# Altium schematic sheet Lab5_prelab1.SchDoc
size A4; SheetNumber: 1; SheetTotal: 1; SPICEModelCacheFLLGQUAP: <root> / <DocumentId>FLLGQUAP</DocumentId> / <CacheFrame Number="0"> / <Model Name="lf353" Kind="CKT"> / <Text>*////////////////////////////////////////////////////////// / *LF353 Wide Bandwidth Dual JFET-Input OP-AMP MACRO-MODEL / *////////////////////////////////////////////////////////// / * / * connections:    non-inverting input / *                 |   inverting input / *                 |   |   positive power supply / *                 |   |   |   negative power supply / *                 |   |   |   |   output / *                 |   |   |   |   | / *                 |   |   |   |   | / .SUBCKT LF353     1   2  99  50  28 / * / * PINOUT ORDER +IN -IN V+ V- OUT / * / * / *Features: / *Low supply current =                1.8mA / *Wide bandwidth =                     4MHz / *High slew rate =                   13V/uS / *Low offset voltage =                 10mV / * / *NOTE: Model is for single device only and simulated / *      supply current is 1/2 of total device current. / * / ****************INPUT STAGE************** / * / IOS 2 1 25P / *^Input offset current / R1 1 3 1E12 / R2 3 2 1E12 / I1 99 4 100U / J1 5 2 4 JX / J2 6 7 4 JX / R3 5 50 20K / R4 6 50 20K / *Fp2=12 MHz / C4 5 6 3.31573E-13 / * / ***********COMMON MODE EFFECT*********** / * / I2 99 50 1.7MA / *^Quiescent supply current / EOS 7 1 POLY(1) 16 49 5E-3 1 / *Input offset voltage.^ / R8 99 49 50K / R9 49 50 50K / * / *********OUTPUT VOLTAGE LIMITING******** / V2 99 8 2.13 / D1 9 8 DX / D2 10 9 DX / V3 10 50 2.13 / * / **************SECOND STAGE************** / * / EH 99 98 99 49 1 / F1 9 98 POLY(1) VA3 0 0 0 1.0985E7 / G1 98 9 5 6 1E-3 / R5 98 9 100MEG / VA3 9 11 0 / *Fp1=40.3 HZ / C3 98 11 39.493P / * / ***************POLE STAGE*************** / * / *Fp3=42 MHz / G3 98 15 9 49 1E-6 / R12 98 15 1MEG / C5 98 15 3.7894E-15 / * / *********COMMON-MODE ZERO STAGE********* / * / G4 98 16 3 49 1E-8 / L2 98 17 31.831M / R13 17 16 1K / * / **************OUTPUT STAGE************** / * / F6  99 50 VA7 1 / F5  99 23 VA8 1 / D5  21 23 DX / VA7 99 21 0 / D6  23 99 DX / E1  99 26 99 15 1 / VA8 26 27 0 / R16 27 28 35 / V5  28 25 0.1V / D4  25 15 DX / V4  24 28 0.1V / D3  15 24 DX / * / ***************MODELS USED************** / * / .MODEL DX D(IS=1E-15) / .MODEL JX PJF(BETA=1.25E-5 VTO=-2.00 IS=50E-12) / * / .ENDS</Text> / </Model> / <Model Name="1n4148" Kind="MDL"> / <Text>.model 1N4148  D(Is=0.1p Rs=16 CJO=2p Tt=12n Bv=100 Ibv=0.1p)</Text> / </Model> / <Model Name="cap" Kind="MDL"> / <Text>*Default semiconductor capacitor / .MODEL CAP C()</Text> / </Model> / </CacheFrame> / </root>
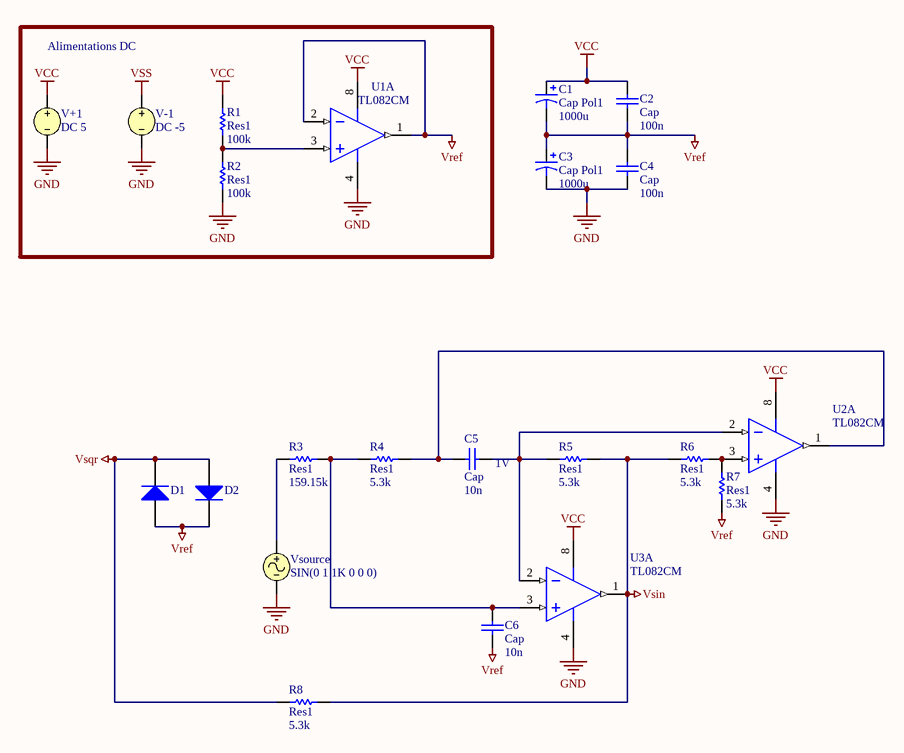
[diagram p0: Lab5_prelab1.SchDoc]

## Parts
C1  Cap Pol1  value 1000u  [RB7.6-15]
C2  Cap  value 100n  [RAD-0.3]
C3  Cap Pol1  value 1000u  [RB7.6-15]
C4  Cap  value 100n  [RAD-0.3]
C5  Cap  value 10n  Initial Voltage: 1V  [RAD-0.3]
C6  Cap  value 10n  [RAD-0.3]
D1  Diode 1N4148  [DO-35]  (value not drawn)
D2  Diode 1N4148  [DO-35]  (value not drawn)
R1  Res1  value 100k  [AXIAL-0.3]
R2  Res1  value 100k  [AXIAL-0.3]
R3  Res1  value 159.15k  [AXIAL-0.3]
R4  Res1  value 5.3k  [AXIAL-0.3]
R5  Res1  value 5.3k  [AXIAL-0.3]
R6  Res1  value 5.3k  [AXIAL-0.3]
R7  Res1  value 5.3k  [AXIAL-0.3]
R8  Res1  value 5.3k  [AXIAL-0.3]
U1  TL082CM  [M08A_N]  (part A of 2)
U2  TL082CM  [M08A_N]  (part A of 2)
U3  TL082CM  [M08A_N]  (part A of 2)
V+1  DC 5
V-1  DC -5
Vsource  SIN(0 1 1K 0 0 0)

## Blocks framed on the sheet
Alimentations DC: R1 R2 U1 V+1 V-1

## Nets
GND: C3.2 C4.1 R2.1 U1.4(V-) U2.4(V-) U3.4(V-) V+1.2 V-1.2 Vsource.2
VCC: C1.1 C2.2 R1.2 U1.8(V+) U2.8(V+) U3.8(V+) V+1.1
Vref: C1.2 C2.1 C3.1 C4.2 C6.1 D1.1(A) D2.2(K) R7.1 U1.1(OUTA) U1.2(INA-)
Vsin: R5.1 R6.2 R8.2 U3.1(OUTA)
Vsqr: D1.2(K) D2.1(A) R8.1
VSS: V-1.1
NetC5_1: C5.1 R4.2 U2.1(OUTA)
NetC5_2: C5.2 R5.2 U2.2(INA-) U3.2(INA-)
NetC6_2: C6.2 R3.2 R4.1 U3.3(INA+)
NetR1_1: R1.1 R2.2 U1.3(INA+)
NetR3_1: R3.1 Vsource.1
NetR6_1: R6.1 R7.2 U2.3(INA+)

## Library data of the parts
C1 C3 = Cap Pol1: Polarized Capacitor (Radial); Published: 8-Jun-2000; LatestRevisionDate: 17-Jul-2002; LatestRevisionNote: Re-released for DXP Platform.; PackageReference: RB7.6-15; Publisher: Altium Limited; PackageDescription: Polarized Capacitor (Radial); 2 Leads
C2 C4-C6 = Cap: Capacitor; Published: 8-Jun-2000; LatestRevisionDate: 17-Jul-2002; LatestRevisionNote: Re-released for DXP Platform.; PackageReference: RAD-0.3; Publisher: Altium Limited; PackageDescription: Radial Cap, Thru-Hole; 2 Leads; 0.3 in Pin Spacing
D1 D2 = Diode 1N4148: High Conductance Fast Diode; Published: 8-Jun-2000; LatestRevisionDate: 17-Jul-2002; LatestRevisionNote: Re-released for DXP Platform.; DatasheetVersion: 1997; PackageReference: DO-35; Publisher: Altium Limited; PackageDescription: Diode, Axial; Body 3.8 x 1.9 mm (LxDia. max), Lead Dia. 0.53 mm (max); Code_JEDEC: DO-204-AH; ComponentLink1Description: Manufacturer Link; ComponentLink1URL: http://www.fairchildsemi.com/; ComponentLink2Description: Datasheet; ComponentLink2URL: http://www.fairchildsemi.com/ds/1N%2F1N4148.pdf
R1-R8 = Res1: Resistor; Published: 8-Jun-2000; LatestRevisionDate: 17-Jul-2002; LatestRevisionNote: Re-released for DXP Platform.; PackageReference: AXIAL-0.3; Publisher: Altium Limited; PackageDescription: Axial Device, Thru-Hole; 2 Leads; 0.3 in Pin Spacing
U1-U3 = TL082CM: Wide Bandwidth Dual JFET Input Operational Amplifier; Manufacturer: National Semiconductor; CompType: Amplifiers; PackageTopMarking: NSZXTT*TL*082CM; PowerWise: N; Published: 4-Dec-2008; LatestRevisionDate: 13-Jan-2009; LatestRevisionNote: Sim Model Added.; DatasheetVersion: Aug-2000; PackageVersion: revL, Sep-2006; PackageReference: M08A; Publisher: Altium Limited; PackageDescription: SOIC Narrow, 4.9 x 3.9 x 1.45mm, 8 Lead, 1.27mm Pitch; PartNumber: TL082CM; RoHS: Y; PinCount: 8; DigiKeyPartNumber: TL082CM-ND; Code_JEDEC: MS-012-AA; Code_IPC: SOIC127P600-8; ComponentLink1Description: TL082 Datasheet; ComponentLink1URL: http://www.national.com/ds/TL/TL082.pdf; ComponentLink2Description: TL082 Web Page; ComponentLink2URL: http://www.national.com/pf/TL/TL082.html; ComponentLink3Description: M08A Package Page; ComponentLink3URL: http://www.national.com/packaging/folders/m08a.html
V+1 = VSRC: Voltage Source; Note: PCB Footprint - Not required; Value: 5; Published: 8-Jun-2000; LatestRevisionDate: 17-Jul-2002; LatestRevisionNote: Re-released for DXP Platform.; PackageReference: Not Applicable; Publisher: Altium Limited
V-1 = VSRC: Voltage Source; Note: PCB Footprint - Not required; Published: 8-Jun-2000; LatestRevisionDate: 17-Jul-2002; LatestRevisionNote: Re-released for DXP Platform.; PackageReference: Not Applicable; Publisher: Altium Limited; Value: -5
Vsource = VSIN: Sinusoidal Voltage Source; Note: PCB Footprint - Not required; Offset: 0; Amplitude: 1; Published: 8-Jun-2000; LatestRevisionDate: 15-Nov-2004; LatestRevisionNote: Corrected Netlist.; PackageReference: Not Applicable; Publisher: Altium Limited; Frequency: 1K; Delay: 0; Damping Factor: 0; Phase: 0; DC Magnitude: 0; AC Magnitude: 1; AC Phase: 0